# EAGLE schematic LX200V20_test (EAGLE 7.4.0)
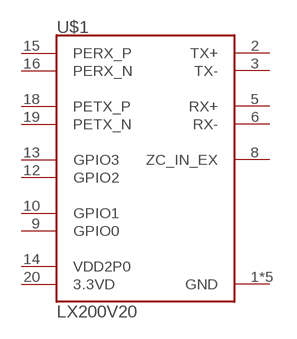
[diagram p0: schematic, sheet 1]

## Parts
U$1  LX200V20  [LX200V20]
Unconnected: U$1.1(GND) U$1.2(TX+) U$1.3(TX-) U$1.4(GND) U$1.5(RX+) U$1.6(RX-) U$1.7(GND) U$1.8(ZC_IN_EX) U$1.9(GPIO0) U$1.10(GPIO1) U$1.11(GND) U$1.12(GPIO2) U$1.13(GPIO3) U$1.14(VDD2P0) U$1.15(PERX_P) U$1.16(PERX_N) U$1.17(GND) U$1.18(PETX_P) U$1.19(PETX_N) U$1.20(3.3VD)

## Library data of the parts
U$1 = BR-Eagle-Library:LX200V20